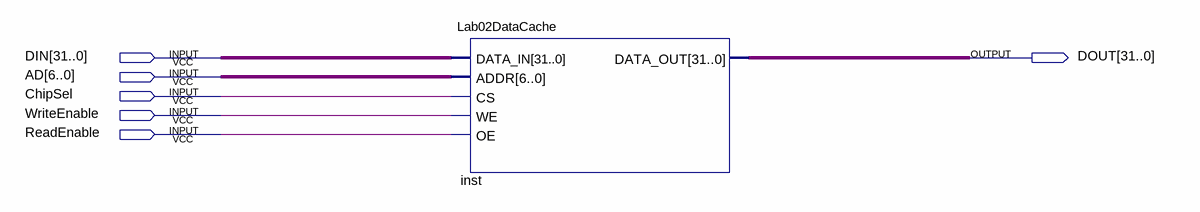
[diagram p0: schematic sheet]
// Quartus schematic DataCache.bdf as structural Verilog: 1 symbols, 6 pins
module DataCache (
  input  [31:0] DIN,
  input  [6:0] AD,
  input  ChipSel,
  input  WriteEnable,
  input  ReadEnable,
  output [31:0] DOUT
);

  Lab02DataCache inst (.DATA_IN(DIN), .ADDR(AD), .CS(ChipSel), .WE(WriteEnable), .OE(ReadEnable), .DATA_OUT(DOUT));
endmodule
